# Altium schematic sheet com.SchDoc: Communications
size A4; DocumentNumber: 4; SheetNumber: 4; SheetTotal: 8
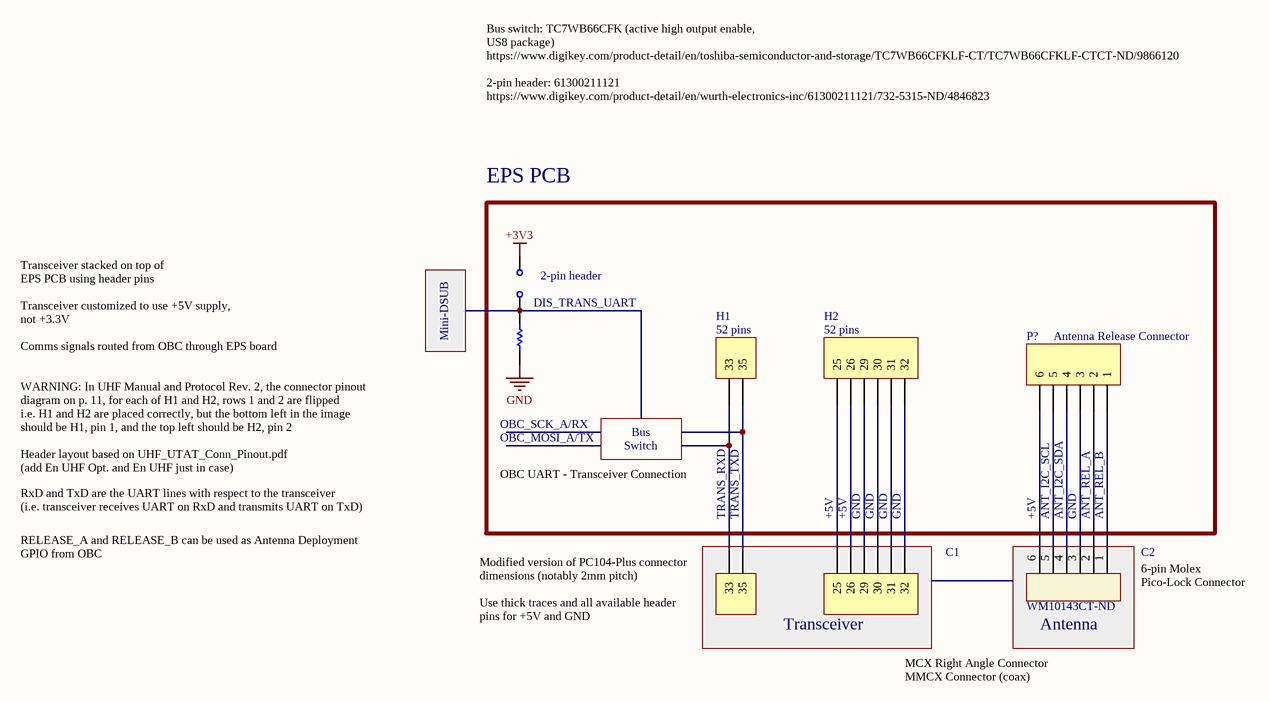
[diagram p0: com.SchDoc]

## Parts
(Parts that share a designator on the sheet are numbered #1, #2 ... from top to bottom, then left to right.)
J?  Supplier Part Number 1: WM10143CT-ND  [MOLEX_504050-0691]  (hidden comment: 504050-0691)
P?#1  Header 2  [HDR1X2]  (value not drawn)
P?#2  Header 6  [HDR1X6]  (value not drawn)
P?#3  Header 6  [HDR1X6]  (value not drawn)
P?#4  Header 2  [HDR1X2]  (value not drawn)
P?#5  Header 6  [HDR1X6]  (value not drawn)
R?  0402  [RES0402R]  (value not drawn)

## Blocks framed on the sheet
EPS PCB: P?#1-P?#3 R?
Transceiver: P?#4 P?#5
Antenna: J?

## Nets
GND: R?.1
NetJ?_1: J?.1 P?#3.1
NetJ?_2: J?.2 P?#3.2
NetJ?_3: J?.3 P?#3.3
NetJ?_4: J?.4 P?#3.4
NetJ?_5: J?.5 P?#3.5
NetJ?_6: J?.6 P?#3.6
NetP?#1_1: P?#1.1(33) P?#4.1(33)
NetP?#1_2: P?#1.2(35) P?#4.2(35)
NetP?#2_1: P?#2.1(25) P?#5.1(25)
NetP?#2_2: P?#2.2(26) P?#5.2(26)
NetP?#2_3: P?#2.3(29) P?#5.3(29)
NetP?#2_4: P?#2.4(30) P?#5.4(30)
NetP?#2_5: P?#2.5(31) P?#5.5(31)
NetP?#2_6: P?#2.6(32) P?#5.6(32)

Not connected (* = marked no-connect by the designer): R? 2

## Notes on the sheet
- Bus switch: TC7WB66CFK (active high output enable, US8 package)
  https://www.digikey.com/product-detail/en/toshiba-semiconductor-and-storage/TC7WB66CFKLF-CT/TC7WB66CFKLF-CTCT-ND/9866120
  2-pin header: 61300211121
  https://www.digikey.com/product-detail/en/wurth-electronics-inc/61300211121/732-5315-ND/4846823
- Transceiver stacked on top of EPS PCB using header pins
- (near R?) 2-pin header
- Comms signals routed from OBC through EPS board
- Transceiver customized to use +5V supply, not +3.3V
  To get 2W of power
  (add En UHF Opt. and En UHF just in case)
- Mini-DSUB
- (near R?) DIS_TRANS_UART
- (near P?#1) 52 pins
- H1
- (near P?#2) 52 pins
- H2
- (near P?#3) Antenna Release Connector
- WARNING: In UHF Manual and Protocol Rev. 2, the connector pinout diagram on p. 11, for each of H1 and H2, rows 1 and 2 are flipped
  i.e. H1 and H2 are placed correctly, but the bottom left in the image should be H1, pin 1, and the top left should be H2, pin 2
- OBC_SCK_A/RX
- Bus
- Header layout based on UHF_UTAT_Conn_Pinout.pdf
  (add En UHF Opt. and En UHF just in case)
- OBC UART - Transceiver Connection
- OBC_MOSI_A/TX
- Switch
- RxD and TxD are the UART lines with respect to the transceiver
  (i.e. transceiver receives UART on RxD and transmits UART on TxD)
- RELEASE_A and RELEASE_B can be used as Antenna Deployment GPIO from OBC
- TRANS_RXD
- TRANS_TXD
- +5V
- GND
- (near P?#5) C1
- ANT_I2C_SCL
- ANT_I2C_SDA
- ANT_REL_A
- ANT_REL_B
- (near J?) C2
- (near P?#4) Modified version of PC104-Plus connector dimensions (notably 2mm pitch)
- (near P?#4) Use thick traces and all available header pins for +5V and GND
- (near J?) 6-pin Molex Pico-Lock Connector
- MCX Right Angle Connector
  MMCX Connector (coax)
- Labels drawn without touching a wire or pin: +3V3

## Library data of the parts
J? = 504050-0691: Wire-To-Board Connector, Pico-Lock 504050 Series, Surface Mount, Header, 6, 1.5 mm; Supplier 1: Digi-Key
P?#1 P?#4 = Header 2: Header, 2-Pin; LatestRevisionDate: 17-Jul-2002; LatestRevisionNote: Re-released for DXP Platform.; Publisher: Altium Limited
P?#2 P?#3 P?#5 = Header 6: Header, 6-Pin; LatestRevisionDate: 17-Jul-2002; LatestRevisionNote: Re-released for DXP Platform.; Publisher: Altium Limited
R? = RES0402: 0402 resistor; Value: Value